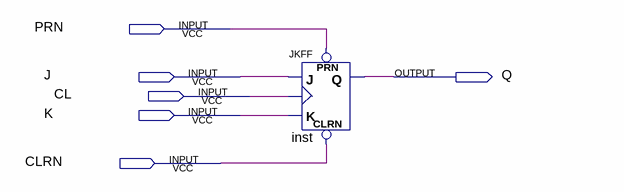
[diagram p0: schematic sheet]
// Quartus schematic jksim.bdf as structural Verilog: 1 symbols, 6 pins
module jksim (
  input  PRN,
  input  J,
  input  CL,
  input  K,
  input  CLRN,
  output Q
);

  JKFF inst (.PRN(PRN), .CLRN(CLRN), .K(K), .J(J), .CLK(CL), .Q(Q));
endmodule
